# Altium project h7new.PrjPcb
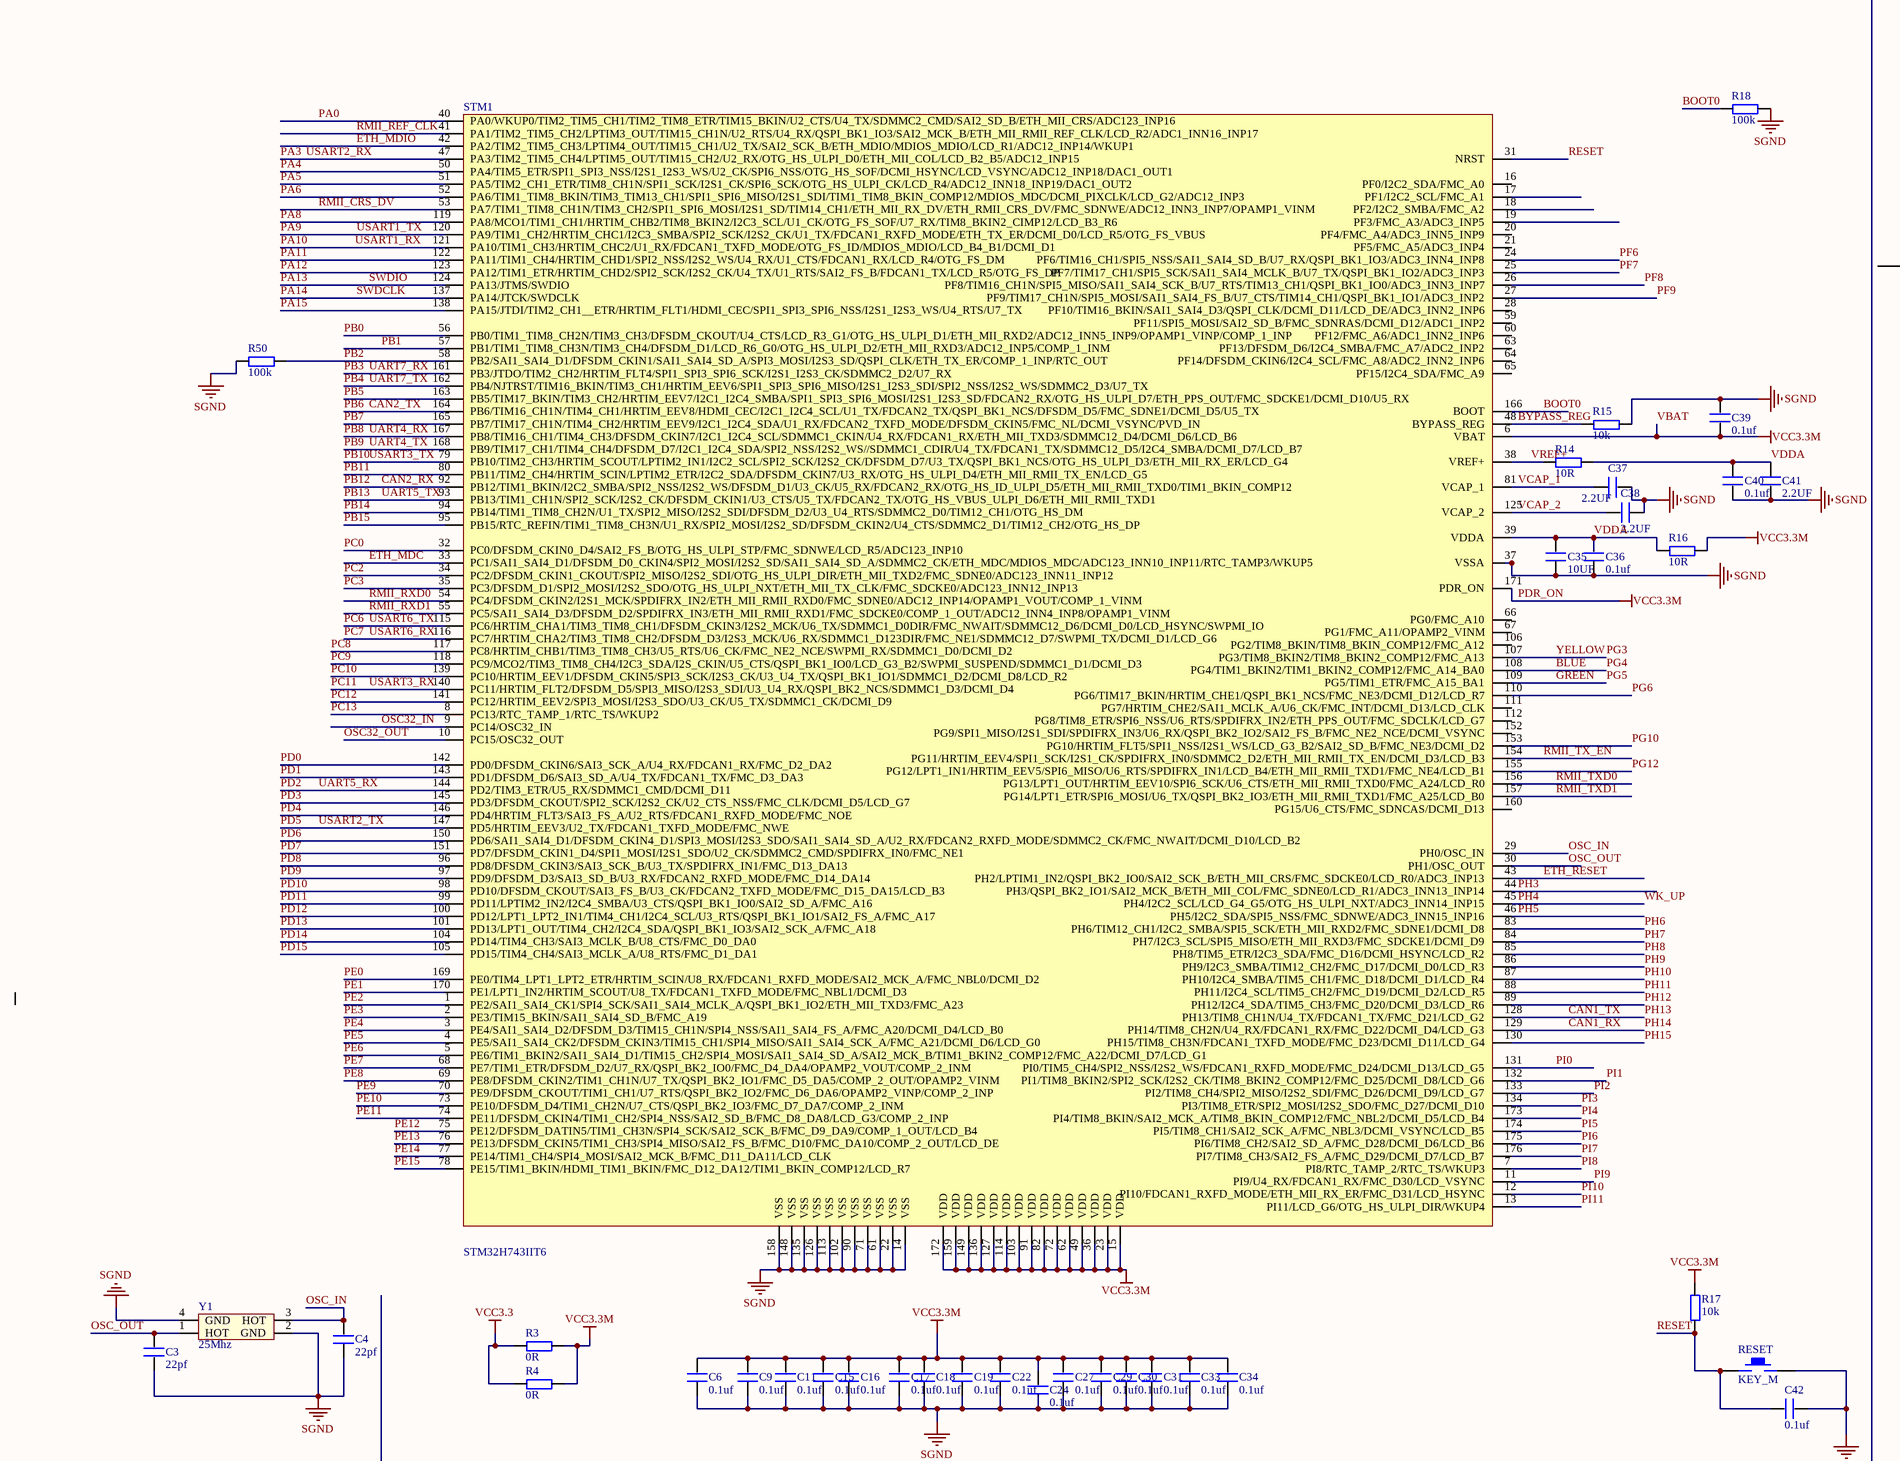
[diagram p0: Sheet1.SchDoc, top left]
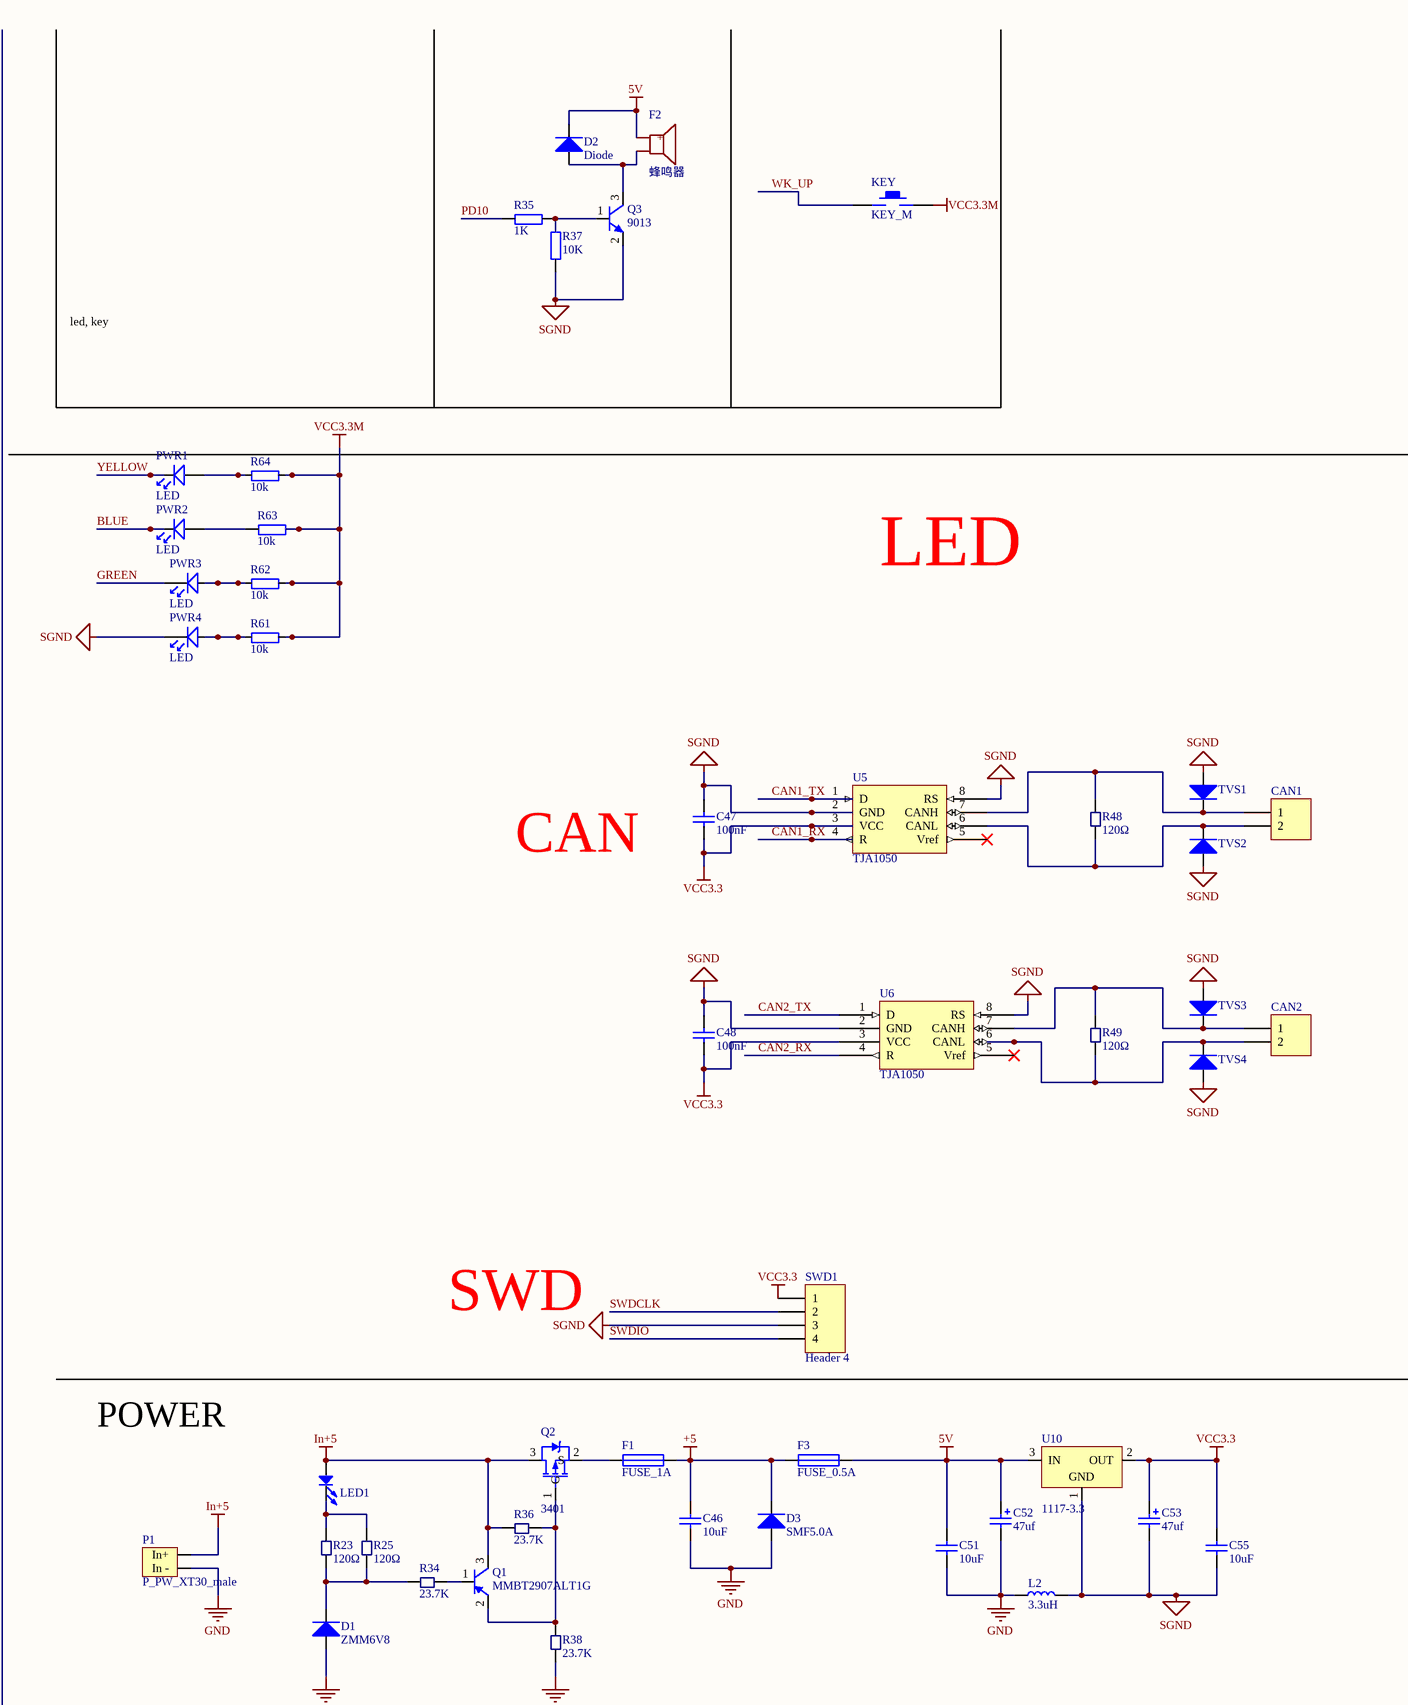
[diagram p1: Sheet1.SchDoc, top right]
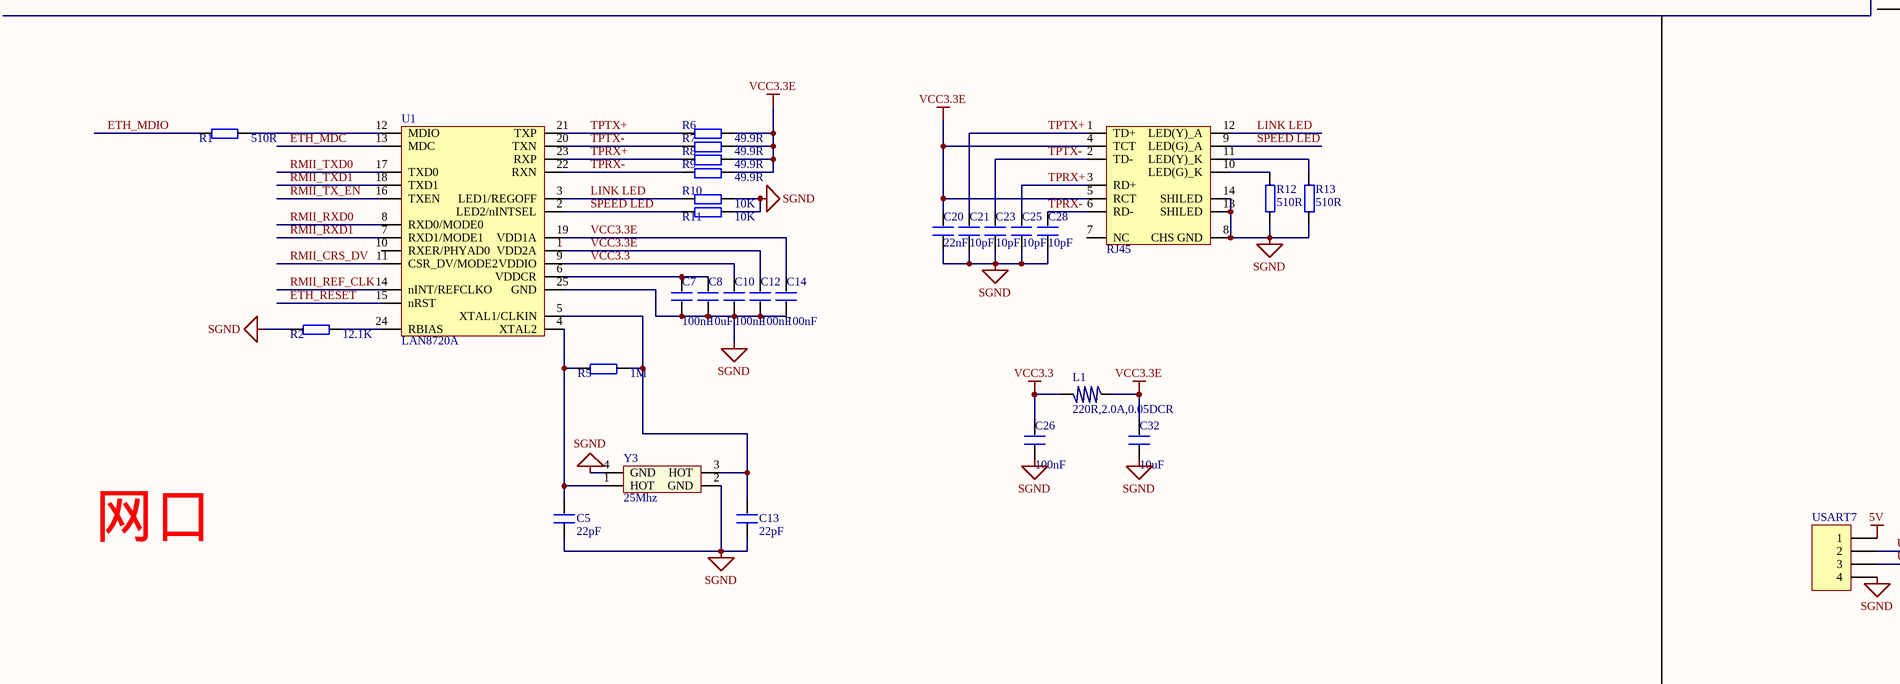
[diagram p2: Sheet1.SchDoc, bottom left]
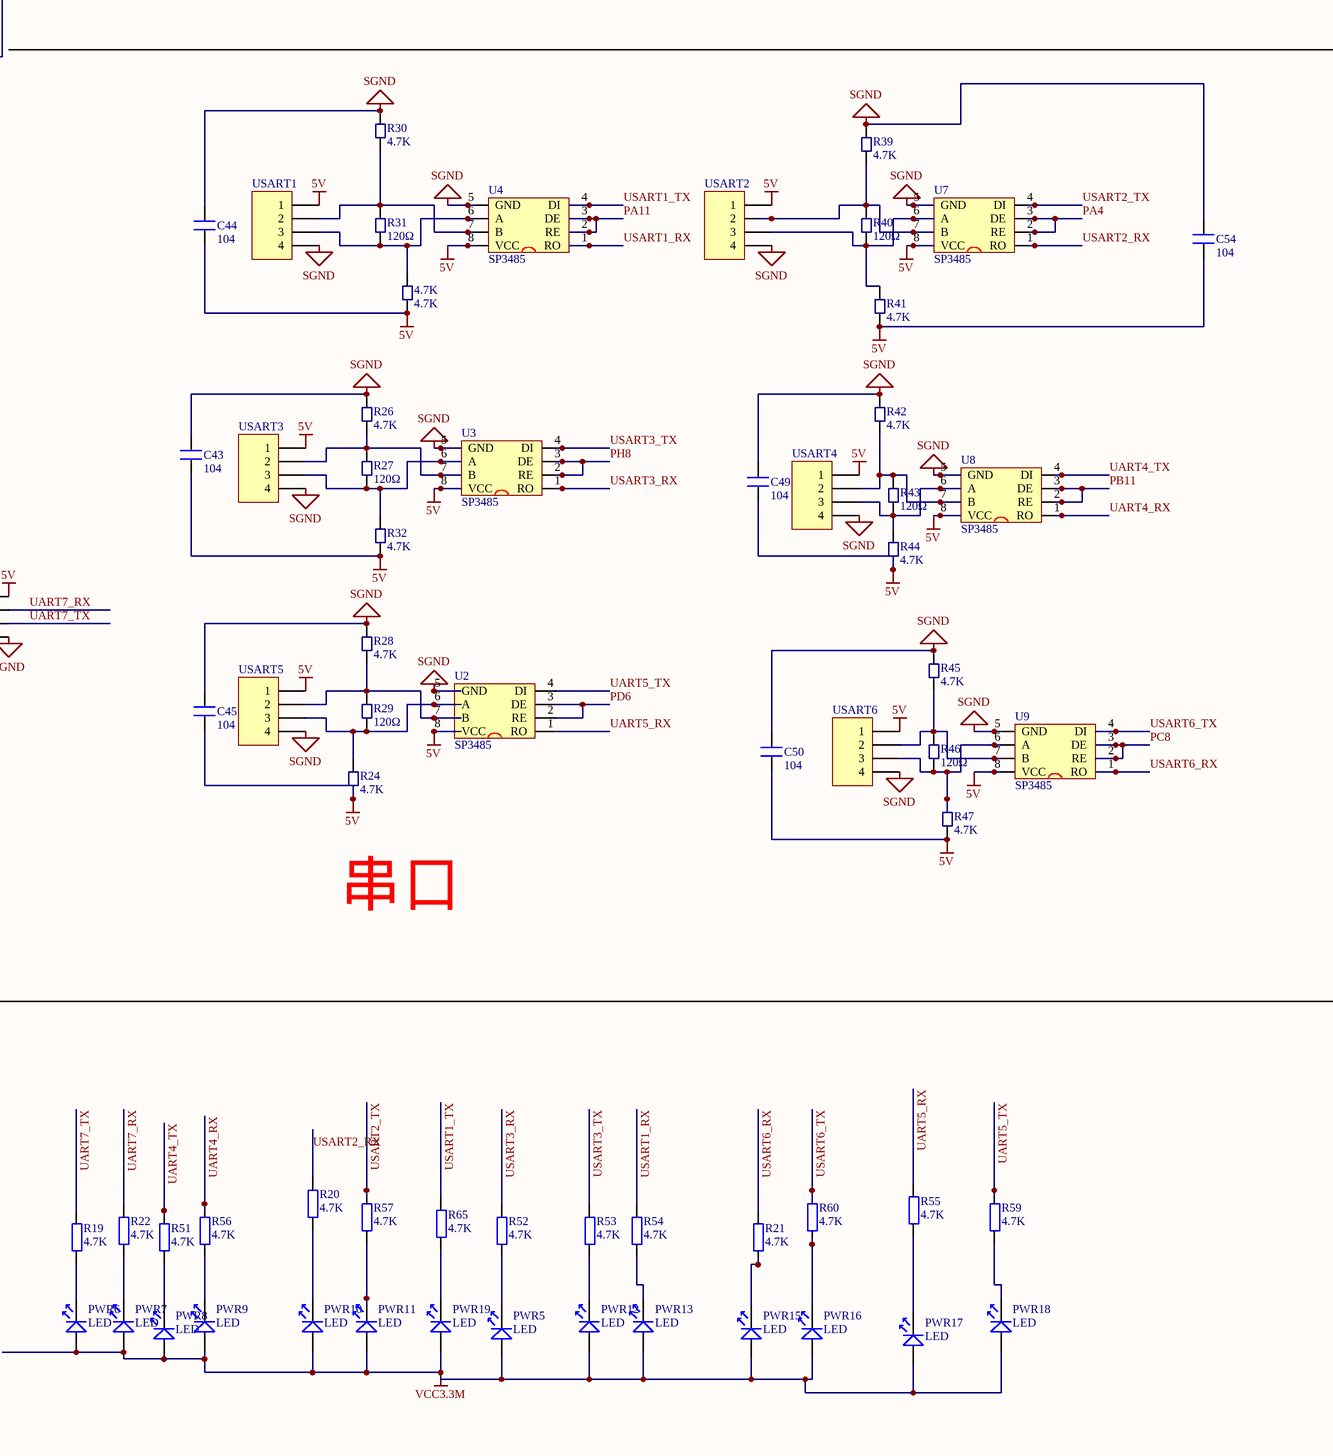
[diagram p3: Sheet1.SchDoc, bottom right]
1 sheet, 178 parts. Net scope: global (net labels, ports and power ports of the same name join across sheets).
Board file: PCB1.PcbDoc

## Sheet Sheet1.SchDoc
size A0; SheetNumber: 1; SheetTotal: 1

### Parts
4.7K  4.7K  [R_0603]
C3  22pf  [0603P]
C4  22pf  [0603P]
C5  22pF  [C_0603]
C6  0.1uf  [0603P]
C7  100nF  [C_0603]
C8  10uF  [C_0603]
C9  0.1uf  [0603P]
C10  100nF  [C_0603]
C11  0.1uf  [0603P]
C12  100nF  [C_0603]
C13  22pF  [C_0603]
C14  100nF  [C_0603]
C15  0.1uf  [0603P]
C16  0.1uf  [0603P]
C17  0.1uf  [0603P]
C18  0.1uf  [0603P]
C19  0.1uf  [0603P]
C20  22nF  [C_0603]
C21  10pF  [C_0603]
C22  0.1uf  [0603P]
C23  10pF  [C_0603]
C24  0.1uf  [0603P]
C25  10pF  [C_0603]
C26  100nF  [C_0603]
C27  0.1uf  [0603P]
C28  10pF  [C_0603]
C29  0.1uf  [0603P]
C30  0.1uf  [0603P]
C31  0.1uf  [0603P]
C32  10uF  [C_0603]
C33  0.1uf  [0603P]
C34  0.1uf  [0603P]
C35  10UF  [0603P]
C36  0.1uf  [0603P]
C37  2.2UF  [0603P]
C38  2.2UF  [0603P]
C39  0.1uf  [0603P]
C40  0.1uf  [0603P]
C41  2.2UF  [0603P]
C42  0.1uf  [0603P]
C43  104  [0603P]
C44  104  [0603P]
C45  104  [0603P]
C46  10uF  [C_0603]
C47  100nF  [C_0603]
C48  100nF  [C_0603]
C49  104  [0603P]
C50  104  [0603P]
C51  10uF  [C_0603]
C52  47uf  [C_A3216]
C53  47uf  [C_A3216]
C54  104  [0603P]
C55  10uF  [C_0603]
CAN1  Header 2  [BM02B-GHS-TBT]  (value not drawn)
CAN2  Header 2  [BM02B-GHS-TBT]  (value not drawn)
D1  ZMM6V8  [LL-34]
D2  Diode  [D_SOD_523]
D3  SMF5.0A  [D_SOD_123]
EARTHNET  RJ45  [HR911105A]
F1  FUSE_1A  [R_0805]
F2  蜂鸣器  [BP_9055]
F3  FUSE_0.5A  [R_0805]
KEY  KEY_M  [KEY_SOP3625]
L1  220R,2.0A,0.05DCR  [L_0603]
L2  3.3uH  [L_0603]
LED1  LED  [0603LED]  (value not drawn)
P1  P_PW_XT30_male  [XT30(Male)]
PWR1  LED  [SMDLED-0603]
PWR2  LED  [SMDLED-0603]
PWR3  LED  [SMDLED-0603]
PWR4  LED  [SMDLED-0603]
PWR5  LED  [SMDLED-0603]
PWR6  LED  [SMDLED-0603]
PWR7  LED  [SMDLED-0603]
PWR8  LED  [SMDLED-0603]
PWR9  LED  [SMDLED-0603]
PWR10  LED  [SMDLED-0603]
PWR11  LED  [SMDLED-0603]
PWR12  LED  [SMDLED-0603]
PWR13  LED  [SMDLED-0603]
PWR15  LED  [SMDLED-0603]
PWR16  LED  [SMDLED-0603]
PWR17  LED  [SMDLED-0603]
PWR18  LED  [SMDLED-0603]
PWR19  LED  [SMDLED-0603]
Q1  MMBT2907ALT1G  [SOT_23]
Q2  3401  [SOT_23]
Q3  9013  [SOT_23]
R1  510R  [R_0603]
R2  12.1K  [R_0603]
R3  0R  [0603P]
R4  0R  [0603P]
R5  1M  [R_0603]
R6  49.9R  [R_0603]
R7  49.9R  [R_0603]
R8  49.9R  [R_0603]
R9  49.9R  [R_0603]
R10  10K  [R_0603]
R11  10K  [R_0603]
R12  510R  [R_0603]
R13  510R  [R_0603]
R14  10R  [0603P]
R15  10k  [0603P]
R16  10R  [0603P]
R17  10k  [0603P]
R18  100k  [0603P]
R19  4.7K  [0603P]
R20  4.7K  [0603P]
R21  4.7K  [0603P]
R22  4.7K  [0603P]
R23  120Ω  [R_0603]
R24  4.7K  [R_0603]
R25  120Ω  [R_0603]
R26  4.7K  [R_0603]
R27  120Ω  [R_0603]
R28  4.7K  [R_0603]
R29  120Ω  [R_0603]
R30  4.7K  [R_0603]
R31  120Ω  [R_0603]
R32  4.7K  [R_0603]
R34  23.7K  [R_0603]
R35  1K  [0603P]
R36  23.7K  [R_0603]
R37  10K  [0603P]
R38  23.7K  [R_0603]
R39  4.7K  [R_0603]
R40  120Ω  [R_0603]
R41  4.7K  [R_0603]
R42  4.7K  [R_0603]
R43  120Ω  [R_0603]
R44  4.7K  [R_0603]
R45  4.7K  [R_0603]
R46  120Ω  [R_0603]
R47  4.7K  [R_0603]
R48  120Ω  [R_0603]
R49  120Ω  [R_0603]
R50  100k  [0603P]
R51  4.7K  [0603P]
R52  4.7K  [0603P]
R53  4.7K  [0603P]
R54  4.7K  [0603P]
R55  4.7K  [0603P]
R56  4.7K  [0603P]
R57  4.7K  [0603P]
R59  4.7K  [0603P]
R60  4.7K  [0603P]
R61  10k  [0603P]
R62  10k  [0603P]
R63  10k  [0603P]
R64  10k  [0603P]
R65  4.7K  [0603P]
RESET  KEY_M  [KEY_SOP3625]
STM1  STM32H743IIT6  [LQFP176]
SWD1  Header 4  [HDR_2.0_4pin]
TVS1  TVS  [D_SOD_123]  (value not drawn)
TVS2  TVS  [D_SOD_123]  (value not drawn)
TVS3  TVS  [D_SOD_123]  (value not drawn)
TVS4  TVS  [D_SOD_123]  (value not drawn)
U1  LAN8720A  [QFN24]
U2  SP3485  [SOP-8]
U3  SP3485  [SOP-8]
U4  SP3485  [SOP-8]
U5  TJA1050  [SOP-8]
U6  TJA1050  [SOP-8]
U7  SP3485  [SOP-8]
U8  SP3485  [SOP-8]
U9  SP3485  [SOP-8]
U10  1117-3.3  [SOT_223]
USART1  Header 4  [BM04B-GHS-TBT]  (value not drawn)
USART2  Header 4  [BM04B-GHS-TBT]  (value not drawn)
USART3  Header 4  [BM04B-GHS-TBT]  (value not drawn)
USART4  Header 4  [BM04B-GHS-TBT]  (value not drawn)
USART5  Header 4  [BM04B-GHS-TBT]  (value not drawn)
USART6  Header 4  [BM04B-GHS-TBT]  (value not drawn)
USART7  Header 4  [BM04B-GHS-TBT]  (value not drawn)
Y1  25Mhz  [XTAL3225]
Y3  25Mhz  [XTAL_3225]

### Nets
5V: 4.7K.1 C43.1 C44.1 C45.1 C49.1 C50.1 C51.2 C52.1(A) C54.1 D2.2(K) F2.1(+) F3.2 R24.1 R32.1 R41.1 R44.1 R47.1 U2.8(VCC) U3.8(VCC) U4.8(VCC) U7.8(VCC) U8.8(VCC) U9.8(VCC) U10.3(IN) USART1.1 USART2.1 USART3.1 USART4.1 USART5.1 USART6.1 USART7.1
+5: C46.2 D3.2(K) F1.2 F3.1
GND: C46.1 C51.1 C52.2(K) D1.1(A) D3.1(A) L2.1 P1.2(In_-) R38.1
In+5: LED1.1(A) P1.1(In+) Q1.3(C) Q2.3(D) R36.1
PDR_ON: C6.2 C9.2 C11.2 C15.2 C16.2 C17.2 C18.2 C19.2 C22.2 C24.2 C27.2 C29.2 C30.2 C31.2 C33.2 C34.2 C39.1 KEY.2 PWR5.1 PWR6.1 PWR7.1 PWR8.1 PWR9.1 PWR10.1 PWR11.1 PWR12.1 PWR13.1 PWR15.1 PWR16.1 PWR17.1 PWR18.1 PWR19.1 R3.2 R4.2 R16.2 R17.2 R61.2 R62.2 R63.2 R64.2 STM1.6(VBAT) STM1.15(VDD) STM1.23(VDD) STM1.36(VDD) STM1.49(VDD) STM1.62(VDD) STM1.72(VDD) STM1.82(VDD) STM1.91(VDD) STM1.103(VDD) STM1.114(VDD) STM1.127(VDD) STM1.136(VDD) STM1.149(VDD) STM1.159(VDD) STM1.171(PDR_ON) STM1.172(VDD)  [also labelled VBAT, VCC3.3M]
SGND: C3.1 C4.1 C5.1 C6.1 C7.1 C8.1 C9.1 C10.1 C11.1 C12.1 C13.1 C14.1 C15.1 C16.1 C17.1 C18.1 C19.1 C20.1 C21.1 C22.1 C23.1 C24.1 C25.1 C26.1 C27.1 C28.1 C29.1 C30.1 C31.1 C32.1 C33.1 C34.1 C35.1 C36.1 C37.2 C38.2 C39.2 C40.1 C41.1 C42.2 C43.2 C44.2 C45.2 C47.2 C48.2 C49.2 C50.2 C53.2(K) C54.2 C55.1 EARTHNET.8(CHS_GND) EARTHNET.13(SHILED) EARTHNET.14(SHILED) L2.2 PWR4.2 Q3.2(E) R2.1 R10.2 R11.2 R12.1 R13.1 R15.2 R18.2 R26.2 R28.2 R30.2 R37.1 R39.2 R42.2 R45.2 R50.1 RESET.2 STM1.14(VSS) STM1.22(VSS) STM1.37(VSSA) STM1.61(VSS) STM1.71(VSS) STM1.90(VSS) STM1.102(VSS) STM1.113(VSS) STM1.126(VSS) STM1.135(VSS) STM1.148(VSS) STM1.158(VSS) SWD1.3 TVS1.1(A) TVS2.1(A) TVS3.1(A) TVS4.1(A) U1.25(GND) U2.5(GND) U3.5(GND) U4.5(GND) U5.2(GND) U5.8(RS) U6.2(GND) U6.8(RS) U7.5(GND) U8.5(GND) U9.5(GND) U10.1(GND) USART1.4 USART2.4 USART3.4 USART4.4 USART5.4 USART6.4 USART7.4 Y1.2(GND) Y1.4(GND) Y3.2(GND) Y3.4(GND)
VCC3.3: C10.2 C26.2 C47.1 C48.1 C53.1(A) C55.2 L1.2 R3.1 R4.1 SWD1.1 U1.9(VDDIO) U5.3(VCC) U6.3(VCC) U10.2(OUT)
VCC3.3E: C12.2 C14.2 C20.2 C32.2 EARTHNET.4(TCT) EARTHNET.5(RCT) L1.1 R6.2 R7.2 R8.2 R9.2 U1.1(VDD2A) U1.19(VDD1A)
BLUE: PWR2.2 STM1.108(PG4/TIM1_BKIN2/TIM1_BKIN2_COMP12/FMC_A14_BA0)  [also labelled PG4]
BOOT0: R18.1 STM1.166(BOOT)
BYPASS_REG: R15.1 STM1.48(BYPASS_REG)
CAN1_RX: STM1.129(PH14/TIM8_CH2N/U4_RX/FDCAN1_RX/FMC_D22/DCMI_D4/LCD_G3) U5.4(R)  [also labelled PH14]
CAN1_TX: STM1.128(PH13/TIM8_CH1N/U4_TX/FDCAN1_TX/FMC_D21/LCD_G2) U5.1(D)  [also labelled PH13]
CAN2_RX: STM1.92(PB12/TIM1_BKIN/I2C2_SMBA/SPI2_NSS/I2S2_WS/DFSDM_D1/U3_CK/U5_RX/FDCAN2_RX/OTG_HS_ID_ULPI_D5/ETH_MII_RMII_TXD0/TIM1_BKIN_COMP12) U6.4(R)  [also labelled PB12]
CAN2_TX: STM1.164(PB6/TIM16_CH1N/TIM4_CH1/HRTIM_EEV8/HDMI_CEC/I2C1_I2C4_SCL/U1_TX/FDCAN2_TX/QSPI_BK1_NCS/DFSDM_D5/FMC_SDNE1/DCMI_D5/U5_TX) U6.1(D)  [also labelled PB6]
ETH_MDC: STM1.33(PC1/SAI1_SAI4_D1/DFSDM_D0_CKIN4/SPI2_MOSI/I2S2_SD/SAI1_SAI4_SD_A/SDMMC2_CK/ETH_MDC/MDIOS_MDC/ADC123_INN10_INP11/RTC_TAMP3/WKUP5) U1.13(MDC)
ETH_MDIO: R1.1 STM1.42(PA2/TIM2_TIM5_CH3/LPTIM4_OUT/TIM15_CH1/U2_TX/SAI2_SCK_B/ETH_MDIO/MDIOS_MDIO/LCD_R1/ADC12_INP14/WKUP1)
ETH_RESET: STM1.43(PH2/LPTIM1_IN2/QSPI_BK2_IO0/SAI2_SCK_B/ETH_MII_CRS/FMC_SDCKE0/LCD_R0/ADC3_INP13) U1.15(nRST)
GREEN: PWR3.2 STM1.109(PG5/TIM1_ETR/FMC_A15_BA1)  [also labelled PG5]
LINK LED: EARTHNET.12(LED(Y)_A) R10.1 U1.3(LED1/REGOFF)
OSC32_IN: STM1.9(PC14/OSC32_IN)
OSC32_OUT: STM1.10(PC15/OSC32_OUT)
OSC_IN: C4.2 STM1.29(PH0/OSC_IN) Y1.3(HOT)
OSC_OUT: C3.2 STM1.30(PH1/OSC_OUT) Y1.1(HOT)
PA0: STM1.40(PA0/WKUP0/TIM2_TIM5_CH1/TIM2_TIM8_ETR/TIM15_BKIN/U2_CTS/U4_TX/SDMMC2_CMD/SAI2_SD_B/ETH_MII_CRS/ADC123_INP16)
PA3: R20.2 STM1.47(PA3/TIM2_TIM5_CH4/LPTIM5_OUT/TIM15_CH2/U2_RX/OTG_HS_ULPI_D0/ETH_MII_COL/LCD_B2_B5/ADC12_INP15) U7.1(RO)  [also labelled USART2_RX]
PA4: STM1.50(PA4/TIM5_ETR/SPI1_SPI3_NSS/I2S1_I2S3_WS/U2_CK/SPI6_NSS/OTG_HS_SOF/DCMI_HSYNC/LCD_VSYNC/ADC12_INP18/DAC1_OUT1) U7.2(RE) U7.3(DE)
PA5: STM1.51(PA5/TIM2_CH1_ETR/TIM8_CH1N/SPI1_SCK/I2S1_CK/SPI6_SCK/OTG_HS_ULPI_CK/LCD_R4/ADC12_INN18_INP19/DAC1_OUT2)
PA6: STM1.52(PA6/TIM1_TIM8_BKIN/TIM3_TIM13_CH1/SPI1_SPI6_MISO/I2S1_SDI/TIM1_TIM8_BKIN_COMP12/MDIOS_MDC/DCMI_PIXCLK/LCD_G2/ADC12_INP3)
PA8: STM1.119(PA8/MCO1/TIM1_CH1/HRTIM_CHB2/TIM8_BKIN2/I2C3_SCL/U1_CK/OTG_FS_SOF/U7_RX/TIM8_BKIN2_CIMP12/LCD_B3_R6)
PA9: R65.2 STM1.120(PA9/TIM1_CH2/HRTIM_CHC1/I2C3_SMBA/SPI2_SCK/I2S2_CK/U1_TX/FDCAN1_RXFD_MODE/ETH_TX_ER/DCMI_D0/LCD_R5/OTG_FS_VBUS) U4.4(DI)  [also labelled USART1_TX]
PA10: R54.2 STM1.121(PA10/TIM1_CH3/HRTIM_CHC2/U1_RX/FDCAN1_TXFD_MODE/OTG_FS_ID/MDIOS_MDIO/LCD_B4_B1/DCMI_D1) U4.1(RO)  [also labelled USART1_RX]
PA11: STM1.122(PA11/TIM1_CH4/HRTIM_CHD1/SPI2_NSS/I2S2_WS/U4_RX/U1_CTS/FDCAN1_RX/LCD_R4/OTG_FS_DM) U4.2(RE) U4.3(DE)
PA12: STM1.123(PA12/TIM1_ETR/HRTIM_CHD2/SPI2_SCK/I2S2_CK/U4_TX/U1_RTS/SAI2_FS_B/FDCAN1_TX/LCD_R5/OTG_FS_DP)
PA13: STM1.124(PA13/JTMS/SWDIO) SWD1.4  [also labelled SWDIO]
PA14: STM1.137(PA14/JTCK/SWDCLK) SWD1.2  [also labelled SWDCLK]
PA15: STM1.138(PA15/JTDI/TIM2_CH1__ETR/HRTIM_FLT1/HDMI_CEC/SPI1_SPI3_SPI6_NSS/I2S1_I2S3_WS/U4_RTS/U7_TX)
PB0: STM1.56(PB0/TIM1_TIM8_CH2N/TIM3_CH3/DFSDM_CKOUT/U4_CTS/LCD_R3_G1/OTG_HS_ULPI_D1/ETH_MII_RXD2/ADC12_INN5_INP9/OPAMP1_VINP/COMP_1_INP)
PB1: STM1.57(PB1/TIM1_TIM8_CH3N/TIM3_CH4/DFSDM_D1/LCD_R6_G0/OTG_HS_ULPI_D2/ETH_MII_RXD3/ADC12_INP5/COMP_1_INM)
PB2: R50.2 STM1.58(PB2/SAI1_SAI4_D1/DFSDM_CKIN1/SAI1_SAI4_SD_A/SPI3_MOSI/I2S3_SD/QSPI_CLK/ETH_TX_ER/COMP_1_INP/RTC_OUT)
PB3: R22.2 STM1.161(PB3/JTDO/TIM2_CH2/HRTIM_FLT4/SPI1_SPI3_SPI6_SCK/I2S1_I2S3_CK/SDMMC2_D2/U7_RX) USART7.2  [also labelled UART7_RX]
PB4: R19.2 STM1.162(PB4/NJTRST/TIM16_BKIN/TIM3_CH1/HRTIM_EEV6/SPI1_SPI3_SPI6_MISO/I2S1_I2S3_SDI/SPI2_NSS/I2S2_WS/SDMMC2_D3/U7_TX) USART7.3  [also labelled UART7_TX]
PB5: STM1.163(PB5/TIM17_BKIN/TIM3_CH2/HRTIM_EEV7/I2C1_I2C4_SMBA/SPI1_SPI3_SPI6_MOSI/I2S1_I2S3_SD/FDCAN2_RX/OTG_HS_ULPI_D7/ETH_PPS_OUT/FMC_SDCKE1/DCMI_D10/U5_RX)
PB7: STM1.165(PB7/TIM17_CH1N/TIM4_CH2/HRTIM_EEV9/I2C1_I2C4_SDA/U1_RX/FDCAN2_TXFD_MODE/DFSDM_CKIN5/FMC_NL/DCMI_VSYNC/PVD_IN)
PB8: R56.2 STM1.167(PB8/TIM16_CH1/TIM4_CH3/DFSDM_CKIN7/I2C1_I2C4_SCL/SDMMC1_CKIN/U4_RX/FDCAN1_RX/ETH_MII_TXD3/SDMMC12_D4/DCMI_D6/LCD_B6) U8.1(RO)  [also labelled UART4_RX]
PB9: R51.2 STM1.168(PB9/TIM17_CH1/TIM4_CH4/DFSDM_D7/I2C1_I2C4_SDA/SPI2_NSS/I2S2_WS//SDMMC1_CDIR/U4_TX/FDCAN1_TX/SDMMC12_D5/I2C4_SMBA/DCMI_D7/LCD_B7) U8.4(DI)  [also labelled UART4_TX]
PB10: R53.2 STM1.79(PB10/TIM2_CH3/HRTIM_SCOUT/LPTIM2_IN1/I2C2_SCL/SPI2_SCK/I2S2_CK/DFSDM_D7/U3_TX/QSPI_BK1_NCS/OTG_HS_ULPI_D3/ETH_MII_RX_ER/LCD_G4) U3.4(DI)  [also labelled USART3_TX]
PB11: STM1.80(PB11/TIM2_CH4/HRTIM_SCIN/LPTIM2_ETR/I2C2_SDA/DFSDM_CKIN7/U3_RX/OTG_HS_ULPI_D4/ETH_MII_RMII_TX_EN/LCD_G5) U8.2(RE) U8.3(DE)
PB13: R59.2 STM1.93(PB13/TIM1_CH1N/SPI2_SCK/I2S2_CK/DFSDM_CKIN1/U3_CTS/U5_TX/FDCAN2_TX/OTG_HS_VBUS_ULPI_D6/ETH_MII_RMII_TXD1) U2.4(DI)  [also labelled UART5_TX]
PB14: STM1.94(PB14/TIM1_TIM8_CH2N/U1_TX/SPI2_MISO/I2S2_SDI/DFSDM_D2/U3_U4_RTS/SDMMC2_D0/TIM12_CH1/OTG_HS_DM)
PB15: STM1.95(PB15/RTC_REFIN/TIM1_TIM8_CH3N/U1_RX/SPI2_MOSI/I2S2_SD/DFSDM_CKIN2/U4_CTS/SDMMC2_D1/TIM12_CH2/OTG_HS_DP)
PC0: STM1.32(PC0/DFSDM_CKIN0_D4/SAI2_FS_B/OTG_HS_ULPI_STP/FMC_SDNWE/LCD_R5/ADC123_INP10)
PC2: STM1.34(PC2/DFSDM_CKIN1_CKOUT/SPI2_MISO/I2S2_SDI/OTG_HS_ULPI_DIR/ETH_MII_TXD2/FMC_SDNE0/ADC123_INN11_INP12)
PC3: STM1.35(PC3/DFSDM_D1/SPI2_MOSI/I2S2_SDO/OTG_HS_ULPI_NXT/ETH_MII_TX_CLK/FMC_SDCKE0/ADC123_INN12_INP13)
PC6: R60.2 STM1.115(PC6/HRTIM_CHA1/TIM3_TIM8_CH1/DFSDM_CKIN3/I2S2_MCK/U6_TX/SDMMC1_D0DIR/FMC_NWAIT/SDMMC12_D6/DCMI_D0/LCD_HSYNC/SWPMI_IO) U9.4(DI)  [also labelled USART6_TX]
PC7: R21.2 STM1.116(PC7/HRTIM_CHA2/TIM3_TIM8_CH2/DFSDM_D3/I2S3_MCK/U6_RX/SDMMC1_D123DIR/FMC_NE1/SDMMC12_D7/SWPMI_TX/DCMI_D1/LCD_G6) U9.1(RO)  [also labelled USART6_RX]
PC8: STM1.117(PC8/HRTIM_CHB1/TIM3_TIM8_CH3/U5_RTS/U6_CK/FMC_NE2_NCE/SWPMI_RX/SDMMC1_D0/DCMI_D2) U9.2(RE) U9.3(DE)
PC9: STM1.118(PC9/MCO2/TIM3_TIM8_CH4/I2C3_SDA/I2S_CKIN/U5_CTS/QSPI_BK1_IO0/LCD_G3_B2/SWPMI_SUSPEND/SDMMC1_D1/DCMI_D3)
PC10: STM1.139(PC10/HRTIM_EEV1/DFSDM_CKIN5/SPI3_SCK/I2S3_CK/U3_U4_TX/QSPI_BK1_IO1/SDMMC1_D2/DCMI_D8/LCD_R2)
PC11: R52.2 STM1.140(PC11/HRTIM_FLT2/DFSDM_D5/SPI3_MISO/I2S3_SDI/U3_U4_RX/QSPI_BK2_NCS/SDMMC1_D3/DCMI_D4) U3.1(RO)  [also labelled USART3_RX]
PC12: STM1.141(PC12/HRTIM_EEV2/SPI3_MOSI/I2S3_SDO/U3_CK/U5_TX/SDMMC1_CK/DCMI_D9)
PC13: STM1.8(PC13/RTC_TAMP_1/RTC_TS/WKUP2)
PD0: STM1.142(PD0/DFSDM_CKIN6/SAI3_SCK_A/U4_RX/FDCAN1_RX/FMC_D2_DA2)
PD1: STM1.143(PD1/DFSDM_D6/SAI3_SD_A/U4_TX/FDCAN1_TX/FMC_D3_DA3)
PD2: R55.2 STM1.144(PD2/TIM3_ETR/U5_RX/SDMMC1_CMD/DCMI_D11) U2.1(RO)  [also labelled UART5_RX]
PD3: STM1.145(PD3/DFSDM_CKOUT/SPI2_SCK/I2S2_CK/U2_CTS_NSS/FMC_CLK/DCMI_D5/LCD_G7)
PD4: STM1.146(PD4/HRTIM_FLT3/SAI3_FS_A/U2_RTS/FDCAN1_RXFD_MODE/FMC_NOE)
PD5: R57.2 STM1.147(PD5/HRTIM_EEV3/U2_TX/FDCAN1_TXFD_MODE/FMC_NWE) U7.4(DI)  [also labelled USART2_TX]
PD6: STM1.150(PD6/SAI1_SAI4_D1/DFSDM_CKIN4_D1/SPI3_MOSI/I2S3_SDO/SAI1_SAI4_SD_A/U2_RX/FDCAN2_RXFD_MODE/SDMMC2_CK/FMC_NWAIT/DCMI_D10/LCD_B2) U2.2(RE) U2.3(DE)
PD7: STM1.151(PD7/DFSDM_CKIN1_D4/SPI1_MOSI/I2S1_SDO/U2_CK/SDMMC2_CMD/SPDIFRX_IN0/FMC_NE1)
PD8: STM1.96(PD8/DFSDM_CKIN3/SAI3_SCK_B/U3_TX/SPDIFRX_IN1/FMC_D13_DA13)
PD9: STM1.97(PD9/DFSDM_D3/SAI3_SD_B/U3_RX/FDCAN2_RXFD_MODE/FMC_D14_DA14)
PD10: R35.1 STM1.98(PD10/DFSDM_CKOUT/SAI3_FS_B/U3_CK/FDCAN2_TXFD_MODE/FMC_D15_DA15/LCD_B3)
PD11: STM1.99(PD11/LPTIM2_IN2/I2C4_SMBA/U3_CTS/QSPI_BK1_IO0/SAI2_SD_A/FMC_A16)
PD12: STM1.100(PD12/LPT1_LPT2_IN1/TIM4_CH1/I2C4_SCL/U3_RTS/QSPI_BK1_IO1/SAI2_FS_A/FMC_A17)
PD13: STM1.101(PD13/LPT1_OUT/TIM4_CH2/I2C4_SDA/QSPI_BK1_IO3/SAI2_SCK_A/FMC_A18)
PD14: STM1.104(PD14/TIM4_CH3/SAI3_MCLK_B/U8_CTS/FMC_D0_DA0)
PD15: STM1.105(PD15/TIM4_CH4/SAI3_MCLK_A/U8_RTS/FMC_D1_DA1)
PE0: STM1.169(PE0/TIM4_LPT1_LPT2_ETR/HRTIM_SCIN/U8_RX/FDCAN1_RXFD_MODE/SAI2_MCK_A/FMC_NBL0/DCMI_D2)
PE1: STM1.170(PE1/LPT1_IN2/HRTIM_SCOUT/U8_TX/FDCAN1_TXFD_MODE/FMC_NBL1/DCMI_D3)
PE2: STM1.1(PE2/SAI1_SAI4_CK1/SPI4_SCK/SAI1_SAI4_MCLK_A/QSPI_BK1_IO2/ETH_MII_TXD3/FMC_A23)
PE3: STM1.2(PE3/TIM15_BKIN/SAI1_SAI4_SD_B/FMC_A19)
PE4: STM1.3(PE4/SAI1_SAI4_D2/DFSDM_D3/TIM15_CH1N/SPI4_NSS/SAI1_SAI4_FS_A/FMC_A20/DCMI_D4/LCD_B0)
PE5: STM1.4(PE5/SAI1_SAI4_CK2/DFSDM_CKIN3/TIM15_CH1/SPI4_MISO/SAI1_SAI4_SCK_A/FMC_A21/DCMI_D6/LCD_G0)
PE6: STM1.5(PE6/TIM1_BKIN2/SAI1_SAI4_D1/TIM15_CH2/SPI4_MOSI/SAI1_SAI4_SD_A/SAI2_MCK_B/TIM1_BKIN2_COMP12/FMC_A22/DCMI_D7/LCD_G1)
PE7: STM1.68(PE7/TIM1_ETR/DFSDM_D2/U7_RX/QSPI_BK2_IO0/FMC_D4_DA4/OPAMP2_VOUT/COMP_2_INM)
PE8: STM1.69(PE8/DFSDM_CKIN2/TIM1_CH1N/U7_TX/QSPI_BK2_IO1/FMC_D5_DA5/COMP_2_OUT/OPAMP2_VINM)
PE9: STM1.70(PE9/DFSDM_CKOUT/TIM1_CH1/U7_RTS/QSPI_BK2_IO2/FMC_D6_DA6/OPAMP2_VINP/COMP_2_INP)
PE10: STM1.73(PE10/DFSDM_D4/TIM1_CH2N/U7_CTS/QSPI_BK2_IO3/FMC_D7_DA7/COMP_2_INM)
PE11: STM1.74(PE11/DFSDM_CKIN4/TIM1_CH2/SPI4_NSS/SAI2_SD_B/FMC_D8_DA8/LCD_G3/COMP_2_INP)
PE12: STM1.75(PE12/DFSDM_DATIN5/TIM1_CH3N/SPI4_SCK/SAI2_SCK_B/FMC_D9_DA9/COMP_1_OUT/LCD_B4)
PE13: STM1.76(PE13/DFSDM_CKIN5/TIM1_CH3/SPI4_MISO/SAI2_FS_B/FMC_D10/FMC_DA10/COMP_2_OUT/LCD_DE)
PE14: STM1.77(PE14/TIM1_CH4/SPI4_MOSI/SAI2_MCK_B/FMC_D11_DA11/LCD_CLK)
PE15: STM1.78(PE15/TIM1_BKIN/HDMI_TIM1_BKIN/FMC_D12_DA12/TIM1_BKIN_COMP12/LCD_R7)
PF6: STM1.24(PF6/TIM16_CH1/SPI5_NSS/SAI1_SAI4_SD_B/U7_RX/QSPI_BK1_IO3/ADC3_INN4_INP8)
PF7: STM1.25(PF7/TIM17_CH1/SPI5_SCK/SAI1_SAI4_MCLK_B/U7_TX/QSPI_BK1_IO2/ADC3_INP3)
PF8: STM1.26(PF8/TIM16_CH1N/SPI5_MISO/SAI1_SAI4_SCK_B/U7_RTS/TIM13_CH1/QSPI_BK1_IO0/ADC3_INN3_INP7)
PF9: STM1.27(PF9/TIM17_CH1N/SPI5_MOSI/SAI1_SAI4_FS_B/U7_CTS/TIM14_CH1/QSPI_BK1_IO1/ADC3_INP2)
PG3: PWR1.2 STM1.107(PG3/TIM8_BKIN2/TIM8_BKIN2_COMP12/FMC_A13)  [also labelled YELLOW]
PG6: STM1.110(PG6/TIM17_BKIN/HRTIM_CHE1/QSPI_BK1_NCS/FMC_NE3/DCMI_D12/LCD_R7)
PG10: STM1.153(PG10/HRTIM_FLT5/SPI1_NSS/I2S1_WS/LCD_G3_B2/SAI2_SD_B/FMC_NE3/DCMI_D2)
PG12: STM1.155(PG12/LPT1_IN1/HRTIM_EEV5/SPI6_MISO/U6_RTS/SPDIFRX_IN1/LCD_B4/ETH_MII_RMII_TXD1/FMC_NE4/LCD_B1)
PH3: STM1.44(PH3/QSPI_BK2_IO1/SAI2_MCK_B/ETH_MII_COL/FMC_SDNE0/LCD_R1/ADC3_INN13_INP14)
PH4: KEY.1 STM1.45(PH4/I2C2_SCL/LCD_G4_G5/OTG_HS_ULPI_NXT/ADC3_INN14_INP15)  [also labelled WK_UP]
PH5: STM1.46(PH5/I2C2_SDA/SPI5_NSS/FMC_SDNWE/ADC3_INN15_INP16)
PH6: STM1.83(PH6/TIM12_CH1/I2C2_SMBA/SPI5_SCK/ETH_MII_RXD2/FMC_SDNE1/DCMI_D8)
PH7: STM1.84(PH7/I2C3_SCL/SPI5_MISO/ETH_MII_RXD3/FMC_SDCKE1/DCMI_D9)
PH8: STM1.85(PH8/TIM5_ETR/I2C3_SDA/FMC_D16/DCMI_HSYNC/LCD_R2) U3.2(RE) U3.3(DE)
PH9: STM1.86(PH9/I2C3_SMBA/TIM12_CH2/FMC_D17/DCMI_D0/LCD_R3)
PH10: STM1.87(PH10/I2C4_SMBA/TIM5_CH1/FMC_D18/DCMI_D1/LCD_R4)
PH11: STM1.88(PH11/I2C4_SCL/TIM5_CH2/FMC_D19/DCMI_D2/LCD_R5)
PH12: STM1.89(PH12/I2C4_SDA/TIM5_CH3/FMC_D20/DCMI_D3/LCD_R6)
PH15: STM1.130(PH15/TIM8_CH3N/FDCAN1_TXFD_MODE/FMC_D23/DCMI_D11/LCD_G4)
PI0: STM1.131(PI0/TIM5_CH4/SPI2_NSS/I2S2_WS/FDCAN1_RXFD_MODE/FMC_D24/DCMI_D13/LCD_G5)
PI1: STM1.132(PI1/TIM8_BKIN2/SPI2_SCK/I2S2_CK/TIM8_BKIN2_COMP12/FMC_D25/DCMI_D8/LCD_G6)
PI2: STM1.133(PI2/TIM8_CH4/SPI2_MISO/I2S2_SDI/FMC_D26/DCMI_D9/LCD_G7)
PI3: STM1.134(PI3/TIM8_ETR/SPI2_MOSI/I2S2_SDO/FMC_D27/DCMI_D10)
PI4: STM1.173(PI4/TIM8_BKIN/SAI2_MCK_A/TIM8_BKIN_COMP12/FMC_NBL2/DCMI_D5/LCD_B4)
PI5: STM1.174(PI5/TIM8_CH1/SAI2_SCK_A/FMC_NBL3/DCMI_VSYNC/LCD_B5)
PI6: STM1.175(PI6/TIM8_CH2/SAI2_SD_A/FMC_D28/DCMI_D6/LCD_B6)
PI7: STM1.176(PI7/TIM8_CH3/SAI2_FS_A/FMC_D29/DCMI_D7/LCD_B7)
PI8: STM1.7(PI8/RTC_TAMP_2/RTC_TS/WKUP3)
PI9: STM1.11(PI9/U4_RX/FDCAN1_RX/FMC_D30/LCD_VSYNC)
PI10: STM1.12(PI10/FDCAN1_RXFD_MODE/ETH_MII_RX_ER/FMC_D31/LCD_HSYNC)
PI11: STM1.13(PI11/LCD_G6/OTG_HS_ULPI_DIR/WKUP4)
RESET: C42.1 R17.1 RESET.1 STM1.31(NRST)
RMII_CRS_DV: STM1.53(PA7/TIM1_TIM8_CH1N/TIM3_CH2/SPI1_SPI6_MOSI/I2S1_SD/TIM14_CH1/ETH_MII_RX_DV/ETH_RMII_CRS_DV/FMC_SDNWE/ADC12_INN3_INP7/OPAMP1_VINM) U1.11(CSR_DV/MODE2)
RMII_REF_CLK: STM1.41(PA1/TIM2_TIM5_CH2/LPTIM3_OUT/TIM15_CH1N/U2_RTS/U4_RX/QSPI_BK1_IO3/SAI2_MCK_B/ETH_MII_RMII_REF_CLK/LCD_R2/ADC1_INN16_INP17) U1.14(nINT/REFCLKO)
RMII_RXD0: STM1.54(PC4/DFSDM_CKIN2/I2S1_MCK/SPDIFRX_IN2/ETH_MII_RMII_RXD0/FMC_SDNE0/ADC12_INP14/OPAMP1_VOUT/COMP_1_VINM) U1.8(RXD0/MODE0)
RMII_RXD1: STM1.55(PC5/SAI1_SAI4_D3/DFSDM_D2/SPDIFRX_IN3/ETH_MII_RMII_RXD1/FMC_SDCKE0/COMP_1_OUT/ADC12_INN4_INP8/OPAMP1_VINM) U1.7(RXD1/MODE1)
RMII_TX_EN: STM1.154(PG11/HRTIM_EEV4/SPI1_SCK/I2S1_CK/SPDIFRX_IN0/SDMMC2_D2/ETH_MII_RMII_TX_EN/DCMI_D3/LCD_B3) U1.16(TXEN)
RMII_TXD0: STM1.156(PG13/LPT1_OUT/HRTIM_EEV10/SPI6_SCK/U6_CTS/ETH_MII_RMII_TXD0/FMC_A24/LCD_R0) U1.17(TXD0)
RMII_TXD1: STM1.157(PG14/LPT1_ETR/SPI6_MOSI/U6_TX/QSPI_BK2_IO3/ETH_MII_RMII_TXD1/FMC_A25/LCD_B0) U1.18(TXD1)
SPEED LED: EARTHNET.9(LED(G)_A) R11.1 U1.2(LED2/nINTSEL)
TPRX+: C25.2 EARTHNET.3(RD+) R8.1 U1.23(RXP)
TPRX-: C28.2 EARTHNET.6(RD-) R9.1 U1.22(RXN)
TPTX+: C21.2 EARTHNET.1(TD+) R6.1 U1.21(TXP)
TPTX-: C23.2 EARTHNET.2(TD-) R7.1 U1.20(TXN)
VCAP_1: C37.1 STM1.81(VCAP_1)
VCAP_2: C38.1 STM1.125(VCAP_2)
VDDA: C35.2 C36.2 C40.2 C41.2 R14.2 R16.1 STM1.39(VDDA)
VREF+: R14.1 STM1.38(VREF+)
Net4.7K_2: 4.7K.2 R31.1 U4.6(A) USART1.3
NetC5_2: C5.2 R5.1 U1.4(XTAL2) Y3.1(HOT)
NetC7_2: C7.2 C8.2 U1.6(VDDCR)
NetC13_2: C13.2 R5.2 U1.5(XTAL1/CLKIN) Y3.3(HOT)
NetCAN1_1: CAN1.1 R48.2 TVS1.2(K) U5.7(CANH)
NetCAN1_2: CAN1.2 R48.1 TVS2.2(K) U5.6(CANL)
NetCAN2_1: CAN2.1 R49.2 TVS3.2(K) U6.7(CANH)
NetCAN2_2: CAN2.2 R49.1 TVS4.2(K) U6.6(CANL)
NetD1_2: D1.2(K) R23.1 R25.1 R34.1
NetD2_1: D2.1(A) F2.2 Q3.3(C)
NetEARTHNET_10: EARTHNET.10(LED(G)_K) R12.2
NetEARTHNET_11: EARTHNET.11(LED(Y)_K) R13.2
NetF1_1: F1.1 Q2.2(S)
NetLED1_2: LED1.2(K) R23.2 R25.2
NetPWR1_1: PWR1.1 R64.1
NetPWR2_1: PWR2.1 R63.1
NetPWR3_1: PWR3.1 R62.1
NetPWR4_1: PWR4.1 R61.1
NetPWR5_2: PWR5.2 R52.1
NetPWR6_2: PWR6.2 R19.1
NetPWR7_2: PWR7.2 R22.1
NetPWR8_2: PWR8.2 R51.1
NetPWR9_2: PWR9.2 R56.1
NetPWR10_2: PWR10.2 R20.1
NetPWR11_2: PWR11.2 R57.1
NetPWR12_2: PWR12.2 R53.1
NetPWR13_2: PWR13.2 R54.1
NetPWR15_2: PWR15.2 R21.1
NetPWR16_2: PWR16.2 R60.1
NetPWR17_2: PWR17.2 R55.1
NetPWR18_2: PWR18.2 R59.1
NetPWR19_2: PWR19.2 R65.1
NetQ1_1: Q1.1(B) R34.2
NetQ1_2: Q1.2(E) Q2.1(G) R36.2 R38.2
NetQ3_1: Q3.1(B) R35.2 R37.2
NetR1_2: R1.2 U1.12(MDIO)
NetR2_2: R2.2 U1.24(RBIAS)
NetR24_2: R24.2 R29.1 U2.6(A) USART5.3
NetR26_1: R26.1 R27.2 U3.7(B) USART3.2
NetR27_1: R27.1 R32.2 U3.6(A) USART3.3
NetR28_1: R28.1 R29.2 U2.7(B) USART5.2
NetR30_1: R30.1 R31.2 U4.7(B) USART1.2
NetR39_1: R39.1 R40.2 U7.7(B) USART2.2
NetR40_1: R40.1 R41.2 U7.6(A) USART2.3
NetR42_1: R42.1 R43.2 U8.7(B) USART4.2
NetR43_1: R43.1 R44.2 U8.6(A) USART4.3
NetR45_1: R45.1 R46.2 U9.7(B) USART6.2
NetR46_1: R46.1 R47.2 U9.6(A) USART6.3

Not connected (* = marked no-connect by the designer): EARTHNET 7(NC); STM1 16(PF0/I2C2_SDA/FMC_A0) 17(PF1/I2C2_SCL/FMC_A1) 18(PF2/I2C2_SMBA/FMC_A2) 19(PF3/FMC_A3/ADC3_INP5) 20(PF4/FMC_A4/ADC3_INN5_INP9) 21(PF5/FMC_A5/ADC3_INP4) 28(PF10/TIM16_BKIN/SAI1_SAI4_D3/QSPI_CLK/DCMI_D11/LCD_DE/ADC3_INN2_INP6) 59(PF11/SPI5_MOSI/SAI2_SD_B/FMC_SDNRAS/DCMI_D12/ADC1_INP2) 60(PF12/FMC_A6/ADC1_INN2_INP6) 63(PF13/DFSDM_D6/I2C4_SMBA/FMC_A7/ADC2_INP2) 64(PF14/DFSDM_CKIN6/I2C4_SCL/FMC_A8/ADC2_INN2_INP6) 65(PF15/I2C4_SDA/FMC_A9) 66(PG0/FMC_A10) 67(PG1/FMC_A11/OPAMP2_VINM) 106(PG2/TIM8_BKIN/TIM8_BKIN_COMP12/FMC_A12) 111(PG7/HRTIM_CHE2/SAI1_MCLK_A/U6_CK/FMC_INT/DCMI_D13/LCD_CLK) 112(PG8/TIM8_ETR/SPI6_NSS/U6_RTS/SPDIFRX_IN2/ETH_PPS_OUT/FMC_SDCLK/LCD_G7) 152(PG9/SPI1_MISO/I2S1_SDI/SPDIFRX_IN3/U6_RX/QSPI_BK2_IO2/SAI2_FS_B/FMC_NE2_NCE/DCMI_VSYNC) 160(PG15/U6_CTS/FMC_SDNCAS/DCMI_D13); U1 10(RXER/PHYAD0); U5 5(Vref)*; U6 5(Vref)*

### Notes on the sheet
- led, key
- LED
- CAN
- SWD
- POWER
- Text
- 网口
- 串口

### Library data of the parts
4.7K R23-R32 R39-R49 = Res2: Resistor; Published: 8-Jun-2000; LatestRevisionDate: 17-Jul-2002; LatestRevisionNote: Re-released for DXP Platform.; PackageReference: AXIAL-0.4; Publisher: Altium Limited
C3-C45 C49 C50 C54 = C
C46 C51 C55 = Cap_4: Capacitor; Published: 8-Jun-2000; LatestRevisionDate: 17-Jul-2002; LatestRevisionNote: Re-released for DXP Platform.; PackageReference: RAD-0.3; Publisher: Altium Limited; PackageDescription: Radial Cap, Thru-Hole; 2 Leads; 0.3 in Pin Spacing
C47 C48 = Cap_2: Capacitor; Published: 8-Jun-2000; LatestRevisionDate: 17-Jul-2002; LatestRevisionNote: Re-released for DXP Platform.; PackageReference: RAD-0.3; Publisher: Altium Limited; PackageDescription: Radial Cap, Thru-Hole; 2 Leads; 0.3 in Pin Spacing
C52 C53 = Cap Pol: Polarized Capacitor (Radial); Published: 8-Jun-2000; LatestRevisionDate: 17-Jul-2002; LatestRevisionNote: Re-released for DXP Platform.; PackageReference: RB7.6-15; Publisher: Altium Limited
CAN1 CAN2 = Header 2: Header, 2-Pin; LatestRevisionDate: 17-Jul-2002; LatestRevisionNote: Re-released for DXP Platform.; Publisher: Altium Limited
D1 = Diode_1: Default Diode; Published: 8-Jun-2000; LatestRevisionDate: 17-Jul-2002; LatestRevisionNote: Re-released for DXP Platform.; PackageVersion: Sep-1996; PackageReference: SMC; Publisher: Altium Limited; PackageDescription: DO-214-AB/SMC; 2 C-Bend Leads; Body 7.9 x 5.9 mm, inc. leads (LxW); Code_JEDEC: DO-214-AB
D2 TVS1-TVS4 = Diode: Default Diode; Published: 8-Jun-2000; LatestRevisionDate: 17-Jul-2002; LatestRevisionNote: Re-released for DXP Platform.; PackageVersion: Sep-1996; PackageReference: SMC; Publisher: Altium Limited; PackageDescription: DO-214-AB/SMC; 2 C-Bend Leads; Body 7.9 x 5.9 mm, inc. leads (LxW); Code_JEDEC: DO-214-AB
D3 = Diode_2: Default Diode; Published: 8-Jun-2000; LatestRevisionDate: 17-Jul-2002; LatestRevisionNote: Re-released for DXP Platform.; PackageVersion: Sep-1996; PackageReference: SMC; Publisher: Altium Limited; PackageDescription: DO-214-AB/SMC; 2 C-Bend Leads; Body 7.9 x 5.9 mm, inc. leads (LxW); Code_JEDEC: DO-214-AB
EARTHNET = HR911105
F1 = FUSE_1: Fuse; Published: 8-Jun-2000; LatestRevisionDate: 17-Jul-2002; LatestRevisionNote: Re-released for DXP Platform.; PackageReference: PIN-W2/E2.8; Publisher: Altium Limited; PackageDescription: Thru-Hole; 2 Leads
F3 = FUSE: Published: 8-Jun-2000; LatestRevisionDate: 17-Jul-2002; LatestRevisionNote: Re-released for DXP Platform.; PackageReference: PIN-W2/E2.8; Publisher: Altium Limited; PackageDescription: Thru-Hole; 2 Leads
L1 = L
L2 = Inductor: Code_IEC: 1005; Published: 8-Jun-2000; LatestRevisionDate: 17-Jul-2002; LatestRevisionNote: Re-released for DXP Platform.; PackageReference: 0402-A; Publisher: Altium Limited; Code_JEITA: 0402
LED1 = LED: Typical INFRARED GaAs LED; Published: 8-Jun-2000; LatestRevisionDate: 08-Jul-2005; LatestRevisionNote: Mech Layer 1 removed.; PackageReference: LED-0; Publisher: Altium Limited; PackageDescription: LED; 2 Leads
P1 = P_PW_XT30_male: XT30_pw_m / XT30母头电源输入
Q1 = PNP: PNP Bipolar Transistor; Published: 8-Jun-2000; LatestRevisionDate: 29-May-2009; LatestRevisionNote: IPC-7351 Footprint Added.; PackageVersion: Aug-1999; PackageReference: SOT-23B; Publisher: Altium Limited; PackageDescription: 3-Pin SOT-23 Package 0.95 mm Pitch, 2.4 mm Lead Span
Q2 = MOSFET_P: HEXFET Power MOSFET; Published: 8-Jun-2000; LatestRevisionDate: 20-Nov-2009; LatestRevisionNote: IPC-7351 Footprint Added.; DatasheetVersion: May-1999; PackageReference: D2PAK; Publisher: Altium Limited; PackageDescription: 3-Pin Transistor Outline Package 2.54 mm Pitch, 15.1 mm Lead Span; ComponentLink1Description: Manufacturer Link; ComponentLink1URL: http://www.irf.com/; ComponentLink2Description: Datasheet; ComponentLink2URL: http://www.irf.com/product-info/datasheets/data/irf1010ns.pdf
Q3 = NPN: NPN Bipolar Transistor; Published: 8-Jun-2000; LatestRevisionDate: 17-Jul-2002; LatestRevisionNote: Re-released for DXP Platform.; PackageReference: TO-226; Publisher: Altium Limited; Code_JEDEC: TO-226-AA
R1-R22 R35 R37 R50-R57 R59-R65 = R
R34 R36 R38 = Res2_1: Resistor; Published: 8-Jun-2000; LatestRevisionDate: 17-Jul-2002; LatestRevisionNote: Re-released for DXP Platform.; PackageReference: AXIAL-0.4; Publisher: Altium Limited
SWD1 USART1-USART7 = Header 4: Header, 4-Pin; LatestRevisionDate: 17-Jul-2002; LatestRevisionNote: Re-released for DXP Platform.; Publisher: Altium Limited
U1 = LAN8720: ETH PHY
U2-U4 U7-U9 = MAX3485
U5 U6 = SN65HVD230D
U10 = LM1117-3.3: 800mA Low-Dropout Linear Regulator, 3-pin TO-220; PartNumber: LM1117T-3.3; Manufacturer: National Semiconductor; PackageTopMarking: NSUZXYTTE#*LM1117T*3.3; PowerWise: N; CompType: LDO IC; Published: 4-Dec-2008; DatasheetVersion: Apr-2006; PackageVersion: revL, Jan-1992; PackageReference: T03B; Publisher: Altium Limited; PackageDescription: TO-220, Molded, 3 Lead, Straight; Supplier 1: Farnell; Supplier Part Number 1: 9485813; RoHS: N; PinCount: 3; ComponentLink1Description: LM1117 Datasheet; ComponentLink1URL: http://www.national.com/ds/LM/LM1117.pdf; ComponentLink2Description: LM1117 Web Page; ComponentLink2URL: http://www.national.com/pf/LM/LM1117.html; ComponentLink3Description: T03B Package Page; ComponentLink3URL: http://www.national.com/packaging/folders/t03b.html
Y1 Y3 = XTAL_3225: 3225贴片无源晶振